# EAGLE design botstep23 (EAGLE 5.11)
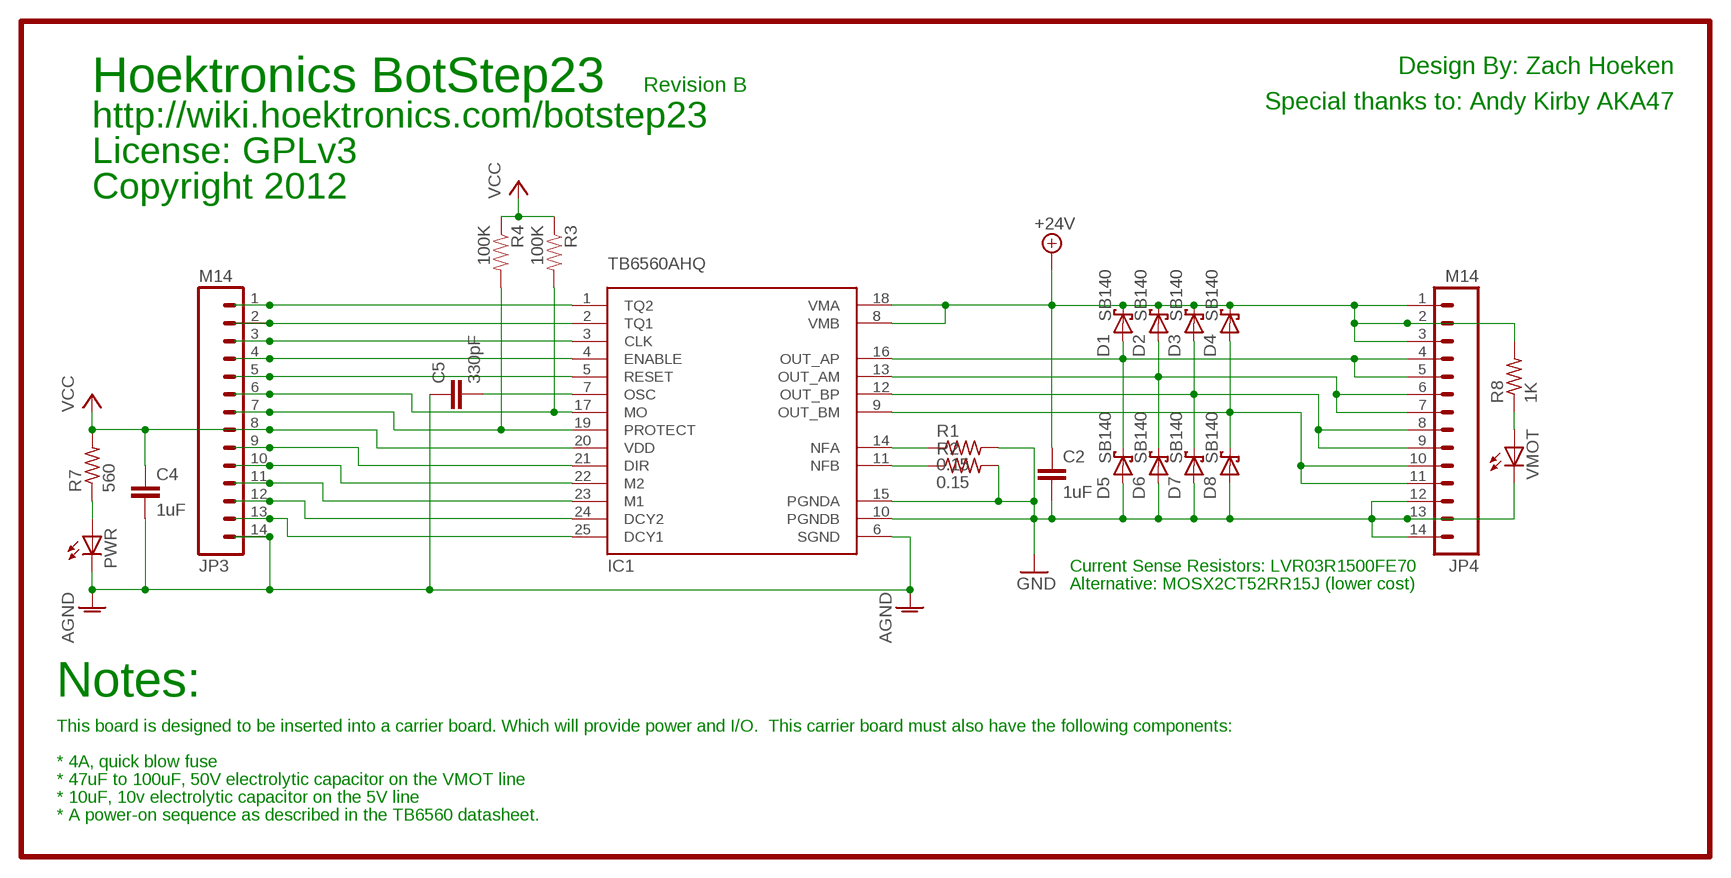
[diagram p0: schematic, sheet 1]

## Parts
C2  1uF  CAPPTH2  [CAP-PTH-SMALL2]
C4  1uF  CAPPTH2  [CAP-PTH-SMALL2]
C5  330pF  CAPPTH2  [CAP-PTH-SMALL2]
D1  SB140  1N5817-B  [DO41-7.6]
D2  SB140  1N5817-B  [DO41-7.6]
D3  SB140  1N5817-B  [DO41-7.6]
D4  SB140  1N5817-B  [DO41-7.6]
D5  SB140  1N5817-B  [DO41-7.6]
D6  SB140  1N5817-B  [DO41-7.6]
D7  SB140  1N5817-B  [DO41-7.6]
D8  SB140  1N5817-B  [DO41-7.6]
IC1  TB6560AHQ  [HZIP25V]
JP3  M14  [1X14]
JP4  M14  [1X14]
PWR  LED3MM  [LED3MM]
R1  0.15  R-US_0613/15  [P0613/15]
R2  0.15  R-US_0613/15  [P0613/15]
R3  100K  RESISTORPTH-1/6W  [1/6W-RES]
R4  100K  RESISTORPTH-1/6W  [1/6W-RES]
R7  560  R-US_0207/2V  [0207/2V]
R8  1K  R-US_0207/2V  [0207/2V]
VMOT  LED3MM  [LED3MM]

## Nets
+24V [power]: C2.1 D1.C D2.C D3.C D4.C IC1.8(VMB) IC1.18(VMA) JP4.1 JP4.2 JP4.3 R8.2
A [power]: D1.A D5.C IC1.16(OUT_AP) JP4.4 JP4.5
AGND: C4.2 C5.1 IC1.6(SGND) JP3.14 PWR.K(C)
B [power]: D2.A D6.C IC1.13(OUT_AM) JP4.6 JP4.7
C [power]: D3.A D7.C IC1.12(OUT_BP) JP4.8 JP4.9
CLK: IC1.3(CLK) JP3.3
D [power]: D4.A D8.C IC1.9(OUT_BM) JP4.10 JP4.11
DCY1: IC1.25(DCY1) JP3.13
DCY2: IC1.24(DCY2) JP3.12
DIR: IC1.21(DIR) JP3.9
ENABLE: IC1.4(ENABLE) JP3.4
M1: IC1.23(M1) JP3.11
M2: IC1.22(M2) JP3.10
MGND [power]: C2.2 D5.A D6.A D7.A D8.A IC1.10(PGNDB) IC1.15(PGNDA) JP4.12 JP4.13 JP4.14 R1.2 R2.2 VMOT.K(C) ; supply symbol labelled GND
MO: IC1.17(MO) JP3.6 R3.2
N$1 [power]: IC1.11(NFB) R2.1
N$2 [power]: IC1.14(NFA) R1.1
N$3: PWR.A R7.1
N$5: R8.1 VMOT.A
N$7: C5.2 IC1.7(OSC)
PROTECT: IC1.19(PROTECT) JP3.7 R4.2
RESET: IC1.5(RESET) JP3.5
TQ1: IC1.2(TQ1) JP3.2
TQ2: IC1.1(TQ2) JP3.1
VCC: C4.1 IC1.20(VDD) JP3.8 R3.1 R4.1 R7.2

## Notes on the sheet
- Design By: Zach Hoeken
- Hoektronics BotStep23 | Revision B | Special thanks to: Andy Kirby AKA47
- http://wiki.hoektronics.com/botstep23
- License: GPLv3
- Copyright 2012
- Current Sense Resistors: LVR03R1500FE70
- Alternative: MOSX2CT52RR15J (lower cost)
- Notes:
- This board is designed to be inserted into a carrier board. Which will provide power and I/O.  This carrier board must also have the following components:
- * 4A, quick blow fuse
- * 47uF to 100uF, 50V electrolytic capacitor on the VMOT line
- * 10uF, 10v electrolytic capacitor on the 5V line
- * A power-on sequence as described in the TB6560 datasheet.

## Library data of the parts
C2 C4 C5 = SparkFun:CAP: Capacitor Standard 0603 ceramic capacitor, and 0.1" leaded capacitor.
D1-D8 = diode:1N581*: 1.0A SCHOTTKY BARRIER RECTIFIER Source: http://www.diodes.com/datasheets/ds23001.pdf
IC1 = Hoeken:TB6560
JP3 JP4 = SparkFun:M14: Header 14 Standard 14-pin 0.1" header. Use with straight break away headers (SKU : PRT-00116), right angle break away headers (PRT-00553), swiss pins (PRT-00743), machine pins (PRT-00117), and female headers (PRT-00115).
PWR VMOT = led:LED: LED OSRAM: - CHIPLED LG R971, LG N971, LY N971, LG Q971, LY Q971, LO R971, LY R971 LH N974, LH R974 LS Q976, LO Q976, LY Q976 LO Q996 - Hyper CHIPLED LW Q18S LB Q993, LB Q99A, LB R99A - SideLED LS A670, LO A670, LY A670, LG A670, LP A670 LB A673, LV A673, LT A673, LW A673 LH A674 LY A675 LS A676, LA A676, LO A676, LY A676, LW A676 LS A679, LY A679, LG A679 - Hyper Micro SIDELED® LS Y876, LA Y876, LO Y876, LY Y876 LT Y87S - SmartLED LW L88C, LW L88S LB L89C, LB L89S, LG L890 LS L89K, LO L89K, LY L89K LS L896, LA L896, LO L896, LY L896 - TOPLED LS T670, LO T670, LY T670, LG T670, LP T670 LSG T670, LSP T670, LSY T670, LOP T670, LYG T670 LG T671, LOG T671, LSG T671 LB T673, LV T673, LT T673, LW T673 LH T674 LS T676, LA T676, LO T676, LY T676, LB T676, LH T676, LSB T676, LW T676 LB T67C, LV T67C, LT T67C, LS T67K, LO T67K, LY T67K, LW E67C LS E67B, LA E67B, LO E67B, LY E67B, LB E67C, LV E67C, LT E67C LW T67C LS T679, LY T679, LG T679 LS T770, LO T770, LY T770, LG T770, LP T770 LB T773, LV T773, LT T773, LW T773 LH T774 LS E675, LA E675, LY E675, LS T675 LS T776, LA T776, LO T776, LY T776, LB T776 LHGB T686 LT T68C, LB T68C - Hyper Mini TOPLED® LB M676 - Mini TOPLED Santana® LG M470 LS M47K, LO M47K, LY M47K Source: http://www.osram.convergy.de LUXEON: - LUMILED® LXK2-PW12-R00, LXK2-PW12-S00, LXK2-PW14-U00, LXK2-PW14-V00 LXK2-PM12-R00, LXK2-PM12-S00, LXK2-PM14-U00 LXK2-PE12-Q00, LXK2-PE12-R00, LXK2-PE12-S00, LXK2-PE14-T00, LXK2-PE14-U00 LXK2-PB12-K00, LXK2-PB12-L00, LXK2-PB12-M00, LXK2-PB14-N00, LXK2-PB14-P00, LXK2-PB14-Q00 LXK2-PR12-L00, LXK2-PR12-M00, LXK2-PR14-Q00, LXK2-PR14-R00 LXK2-PD12-Q00, LXK2-PD12-R00, LXK2-PD12-S00 LXK2-PH12-R00, LXK2-PH12-S00 LXK2-PL12-P00, LXK2-PL12-Q00, LXK2-PL12-R00 Source: www.luxeon.com KINGBRIGHT: KA-3528ASYC Source: www.kingbright.com
R1 R2 = rcl:R-US_: RESISTOR, American symbol
R3 R4 = SparkFun:RESISTOR: Resistor Basic schematic elements and footprints for 0603, 1206, and PTH 1/10th watt (small) resistors.
R7 R8 = resistor:R-US_: RESISTOR, American symbol

## Net classes
1 power: width 1.27 mm, clearance 0.61 mm

## Board
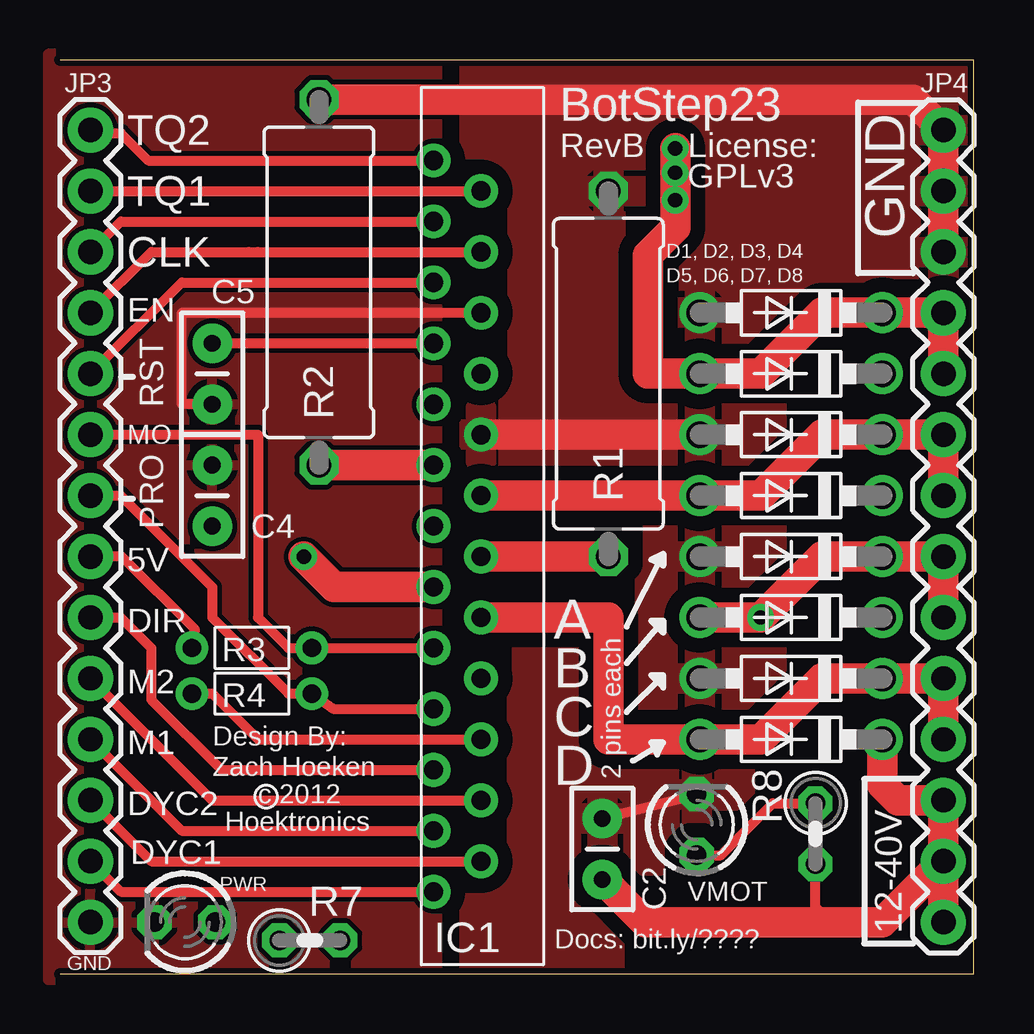
[diagram p1: board, top side]
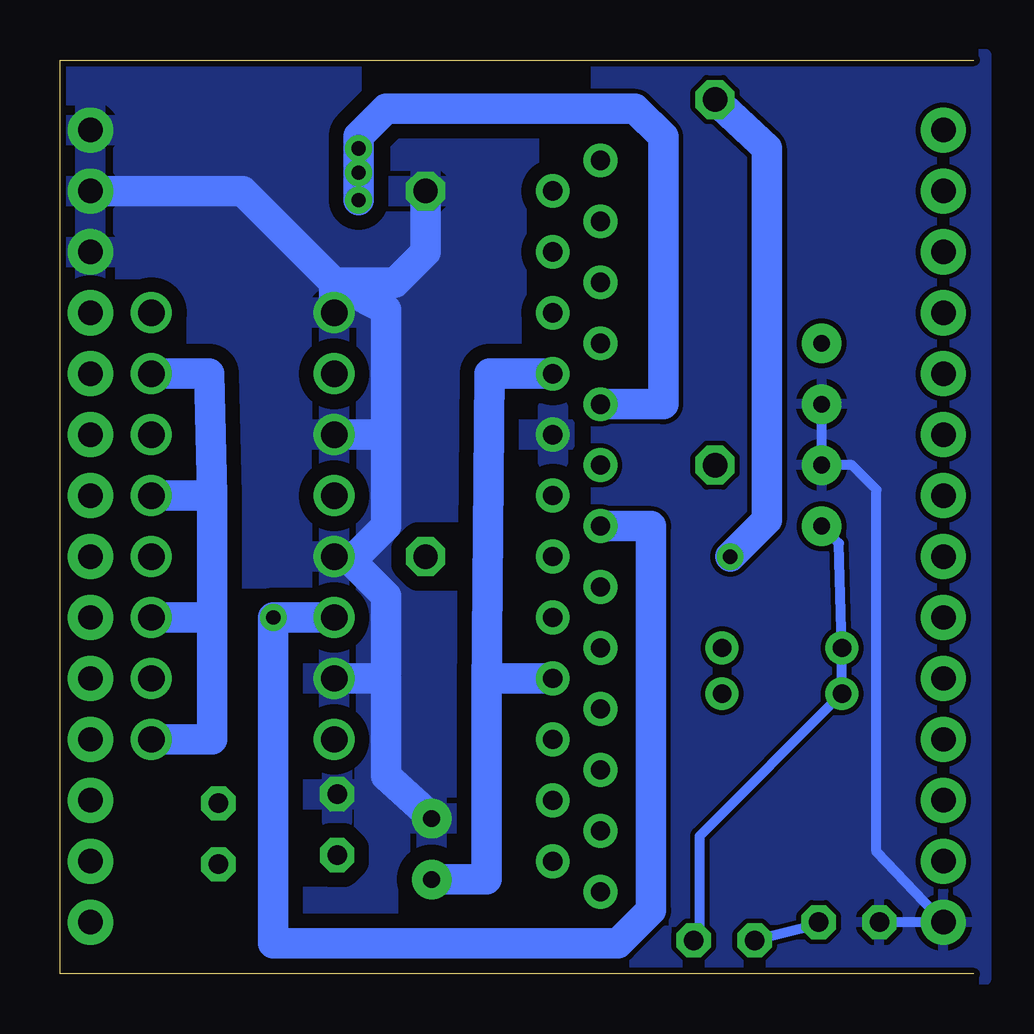
[diagram p2: board, bottom side, seen from below]

Size 38.1 x 38.1 mm. Coordinates in mm from the lower left corner, seen from the top.
Outline: 0,0 38.1,0 38.1,38.1 0,38.1
Copper layers (1*16): Top 0.035mm / dielectric 1.5mm / Bottom 0.035mm
Design rules "SparkFun": minimum track width 8mil, minimum drill 20mil, track to track 8mil, track to pad 8mil, pad to pad 8mil, via to via 8mil, smd to smd 8mil, copper to edge 10mil, drill to drill 8mil, minimum pad ring 12mil, minimum via ring 10mil, stop-mask expansion 4mil, vias tented up to drill 25mil, thermal gap 10mil

### Footprints (pad centres in the part's own frame; a part is rotated, then mirrored left to right if it is on the bottom)
CAP-PTH-SMALL2 = drill 0.7 pad 1.651 round: 1 0,0; 2 2.54,0
DO41-7.6 = drill 1.1 pad 1.7 round: A 3.81,0; C -3.81,0
HZIP25V = drill 0.8 round: 1 0,15.24; 2 1.981,13.97; 3 0,12.7; 4 1.981,11.43; 5 0,10.16; 6 1.981,8.89; 7 0,7.62; 8 1.981,6.35; 9 0,5.08; 10 1.981,3.81; 11 0,2.54; 12 1.981,1.27; 13 0,0; 14 1.981,-1.27; 15 0,-2.54; 16 1.981,-3.81; 17 0,-5.08; 18 1.981,-6.35; 19 0,-7.62; 20 1.981,-8.89; 21 0,-10.16; 22 1.981,-11.43; 23 0,-12.7; 24 1.981,-13.97; 25 0,-15.24
1X14 = drill 1.016 pad 1.88 round: 1 0,0; 2 2.54,0; 3 5.08,0; 4 7.62,0; 5 10.16,0; 6 12.7,0; 7 15.24,0; 8 17.78,0; 9 20.32,0; 10 22.86,0; 11 25.4,0; 12 27.94,0; 13 30.48,0; 14 33.02,0
LED3MM = drill 0.813 octagon: A -1.27,0; K 1.27,0
P0613/15 = drill 1.016 octagon: 1 -7.62,0; 2 7.62,0
1/6W-RES = drill 0.762 round: 1 -2.5,0; 2 2.5,0
0207/2V = drill 0.813 octagon: 1 -1.27,0; 2 1.27,0

### Placement (x,y rotation side)
C2  22.61,3.94 90 top
C4  6.35,18.67 90 top
C5  6.35,23.75 90 top
D1  30.48,9.78 180 top
D2  30.48,14.86 180 top
D3  30.48,19.94 180 top
D4  30.48,25.02 180 top
D5  30.48,12.32 180 top
D6  30.48,17.4 180 top
D7  30.48,22.48 180 top
D8  30.48,27.56 180 top
IC1  15.57,18.67 0 top
JP3  1.27,35.18 270 top
JP4  36.83,2.16 90 top
PWR  5.21,2.16 180 top
R1  22.86,25.02 90 top
R2  10.79,28.83 90 top
R3  8,13.59 0 top
R4  8,11.68 0 top
R7  10.41,1.4 0 top
R8  31.5,5.84 270 top
VMOT  26.54,6.22 90 top

### Tracks (layer width: path | path; a pad name or v marks a point on that pad's centre or on a via)
+24V
  Top 0.406: 30.48,2.16 30.21,2.42 | R8.2 31.5,2.79 32.13,2.16
  Top 1.27: JP4.2 JP4.1 | JP4.2 JP4.3 34.92,7.24 34.29,7.87 D1.C | C2.1 24.38,2.16 30.48,2.16 32.13,2.16 34.29,2.16 JP4.2
  Bottom 1.27: D4.C 31.88,25.02 31.75,19.94 | 31.75,14.86 31.75,9.78 D1.C | 31.75,14.86 31.75,19.94 | 31.75,19.94 D3.C | 31.75,14.86 D2.C | 20.32,11.81 20.19,25.02 IC1.8 | IC1.18 20.32,12.32 20.32,11.81 | C2.1 20.32,3.94 20.32,11.81
A
  Top 1.27: IC1.16 22.86,14.86 22.86,9.78 D1.A 29.21,9.78 31.75,12.32 D5.C JP4.5 JP4.4
AGND
  Top 0.406: C5.1 5.08,23.75 5.08,27.56 IC1.6
  Bottom 0.406: C5.1 C4.2 5.08,21.21 4.06,20.19 4.06,5.08 JP3.14 PWR.K
  pour Top: 15.75,38.35 -0.51,38.35 -0.51,-0.25 15.75,-0.25
  pour Bottom: 15.75,38.35 -0.51,38.35 -0.51,-0.25 15.75,-0.25
B  (via drill 0.6)
  Top 1.27: D2.A v29.21,14.86 31.75,17.4 D6.C JP4.7 JP4.6
  Bottom 1.27: IC1.13 13.46,18.67 13.46,2.64 14.84,1.27 29.21,1.27 v29.21,14.86 D2.A
C
  Top 1.27: IC1.12 D3.A 29.21,19.94 31.75,22.48 D7.C JP4.9 JP4.8
CLK
  Top 0.406: IC1.3 2.54,31.37 JP3.3
D  (via drill 0.6)
  Top 1.27: v25.65,34.42 v25.65,33.4 v25.65,32.26 25.65,31.11 24.51,29.97 24.51,25.02 D4.A 29.21,25.02 31.75,27.56 D8.C JP4.11 JP4.10
  Bottom 1.27: IC1.9 12.95,23.75 12.95,34.89 14.13,36.07 24.51,36.07 25.65,34.92 v25.65,34.42 v25.65,32.26
DCY1
  Top 0.406: IC1.25 2.54,3.43 JP3.13
DCY2
  Top 0.406: IC1.24 3.81,4.7 JP3.12
DIR
  Top 0.406: JP3.9 2.54,14.86 3.81,13.59 3.81,11.43 6.73,8.51 IC1.21
ENABLE
  Top 0.406: JP3.4 3.81,30.1 7.87,30.1 8.26,30.1 IC1.4
M1
  Top 0.406: IC1.23 5.08,5.97 JP3.11
M2
  Top 0.406: IC1.22 6.35,7.24 JP3.10
MGND  (via drill 0.6)
  Top 0.406: C2.2 VMOT.K
  Top 1.27: JP4.12 JP4.13 JP4.14 35.56,36.45 R2.2 | D7.A IC1.10 | IC1.15 11.43,16.13 v10.16,17.4
  Bottom 1.27: 26.67,28.83 D8.A | 24.51,22.48 24.51,27.69 26.67,28.83 | 24.51,22.48 D7.A | C2.2 23.11,6.99 24.51,8.26 24.51,12.32 D5.A 24.77,12.32 24.51,12.57 24.51,15.75 26.16,17.4 | v10.16,17.4 8.64,18.92 8.64,34.42 R2.2 | JP4.13 30.48,32.64 26.67,28.83 | R1.2 22.86,30.1 24.13,28.83 26.67,28.83 | 26.16,17.4 25.78,17.4 24.51,18.67 24.51,22.48 | 26.16,17.4 D6.A
  pour Bottom: 17.27,38.35 38.61,38.35 38.61,-0.25 17.27,-0.25
  pour Top: 17.27,38.35 38.61,38.35 38.61,-0.25 17.27,-0.25
MO
  Top 0.406: IC1.17 R3.2 9.53,13.59 8.26,14.86 8.26,22.48 JP3.6
N$1
  Top 1.27: R2.1 IC1.11
N$2
  Top 1.27: IC1.14 R1.1
N$3
  Bottom 0.406: R7.1 6.6,2.03 PWR.A
N$5
  Top 0.406: R8.1 29.72,7.11 27.56,4.95 VMOT.A
N$7
  Top 0.406: C5.2 IC1.7
PROTECT
  Top 0.406: JP3.7 2.54,19.94 6.35,16.13 6.35,14.86 9.53,11.68 R4.2 11.39,11.05 IC1.19
RESET
  Top 0.406: IC1.5 5.08,28.83 JP3.5
TQ1
  Top 0.406: JP3.2 IC1.2
TQ2
  Top 0.406: IC1.1 3.68,33.91 2.54,35.05 1.4,35.05 JP3.1
VCC
  Top 0.406: 5.71,11.64 R4.1 6.35,11.68 8.26,9.78 IC1.20 | R3.1 5.63,14.35 2.58,17.4 JP3.8
  Bottom 0.406: R4.1 R3.1 5.63,17.95 C4.1 | R4.1 5.71,11.64 | R4.1 11.43,5.75 11.43,1.91 11.68,1.65 R7.2

### Text on the board
tPlace: BotStep23 | TQ2 | RevB | License: | GPLv3 | TQ1 | GND | D1, D2, D3, D4 | CLK | D5, D6, D7, D8 | EN | RST | MO | PRO | 5V | DIR | A | M2 | B | Design By: | C | M1 | Zach Hoeken | D | 2 pins each | DYC2 | c 2012 | Hoektronics | DYC1 | /home/hoeken/Desktop/eagle-5.10.0/projects/examples/stepper-driver/chart.bmp | 12-40V | GND | Docs: bit.ly/????